# EAGLE design Freeduino_Pico_V3_0a (EAGLE 5.00)
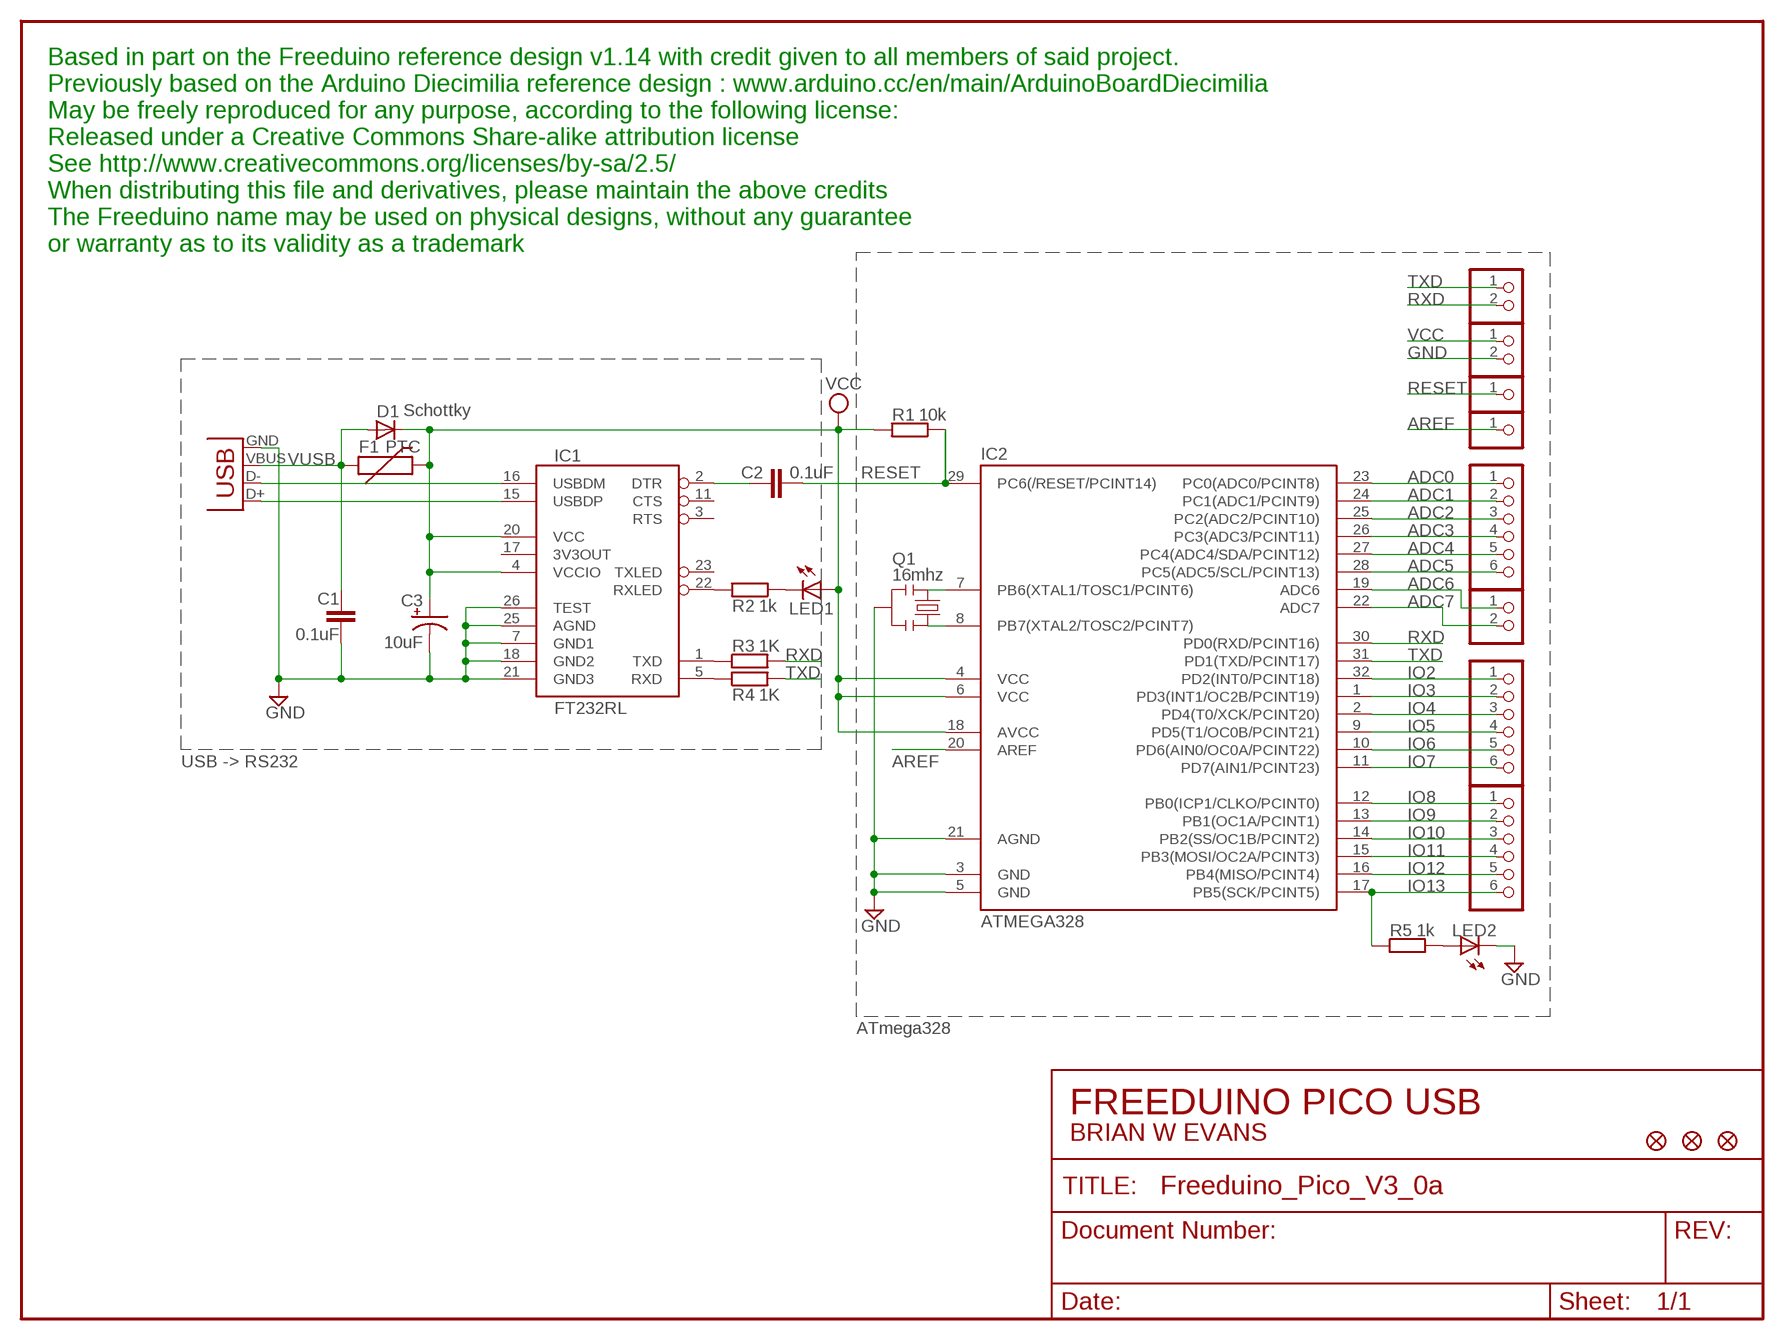
[diagram p0: schematic, sheet 1]

## Parts
C1  0.1uF  CAP0402  [C0402]
C2  0.1uF  CAP0402  [C0402]
C3  10uF  CAP_POL1206  [EIA3216]
D1  DIODESOD  [SOD-323]
F1  PTC  PTCSMD  [PTC-1206]
IC1  FT232RL  FT232RL-BASIC-DTR  [SSOP28DB]
IC2  ATMEGA328  ATMEGA48/88/168RD  [TQFP32-45-ROUND]
JP1  PINHD-1X6  [1X06]
JP2  PINHD-1X2  [1X02]
JP3  PINHD-1X6  [1X06]
JP4  PINHD-1X6  [1X06]
JP5  PINHD-1X2  [1X02]
JP6  PINHD-1X2  [1X02]
JP7  PINHD-1X1  [1X01]
JP8  PINHD-1X1  [1X01]
LED1  LEDCHIPLED_0603  [CHIPLED_0603]
LED2  LEDCHIPLED_0603  [CHIPLED_0603]
Q1  16mhz  RESONATORSMD  [RESONATOR-SMD]
R1  10k  R-EU_R0402  [R0402]
R2  1k  R-EU_R0402  [R0402]
R3  1K  R-EU_R0402  [R0402]
R4  1K  R-EU_R0402  [R0402]
R5  1k  R-EU_R0402  [R0402]
U$2  FIDUCIAL1X2  [FIDUCIAL-1X2]
U$4  FIDUCIAL1X2  [FIDUCIAL-1X2]
U$5  FIDUCIAL1X2  [FIDUCIAL-1X2]
X1  USBSMD  [USB-MINIB]

## Nets
ADC0: IC2.23(PC0(ADC0/PCINT8)) JP1.1
ADC1: IC2.24(PC1(ADC1/PCINT9)) JP1.2
ADC2: IC2.25(PC2(ADC2/PCINT10)) JP1.3
ADC3: IC2.26(PC3(ADC3/PCINT11)) JP1.4
ADC4: IC2.27(PC4(ADC4/SDA/PCINT12)) JP1.5
ADC5: IC2.28(PC5(ADC5/SCL/PCINT13)) JP1.6
ADC6: IC2.19(ADC6) JP2.1
ADC7: IC2.22(ADC7) JP2.2
AREF: IC2.20(AREF) JP7.1
GND: C1.1 C3.C(-) IC1.7(GND1) IC1.18(GND2) IC1.21(GND3) IC1.25(AGND) IC1.26(TEST) IC2.3(GND) IC2.5(GND) IC2.21(AGND) JP6.2 LED2.C Q1.2 X1.GND
IO2: IC2.32(PD2(INT0/PCINT18)) JP3.1
IO3: IC2.1(PD3(INT1/OC2B/PCINT19)) JP3.2
IO4: IC2.2(PD4(T0/XCK/PCINT20)) JP3.3
IO5: IC2.9(PD5(T1/OC0B/PCINT21)) JP3.4
IO6: IC2.10(PD6(AIN0/OC0A/PCINT22)) JP3.5
IO7: IC2.11(PD7(AIN1/PCINT23)) JP3.6
IO8: IC2.12(PB0(ICP1/CLKO/PCINT0)) JP4.1
IO9: IC2.13(PB1(OC1A/PCINT1)) JP4.2
IO10: IC2.14(PB2(SS/OC1B/PCINT2)) JP4.3
IO11: IC2.15(PB3(MOSI/OC2A/PCINT3)) JP4.4
IO12: IC2.16(PB4(MISO/PCINT4)) JP4.5
IO13: IC2.17(PB5(SCK/PCINT5)) JP4.6 R5.1
N$1: IC1.16(USBDM) X1.D-
N$2: IC1.15(USBDP) X1.D+
N$3: LED1.C R2.1
N$4: IC1.5(RXD) R4.1
N$5: C2.1 IC1.2(DTR)
N$7: IC2.7(PB6(XTAL1/TOSC1/PCINT6)) Q1.1
N$8: IC2.8(PB7(XTAL2/TOSC2/PCINT7)) Q1.3
N$9: IC1.1(TXD) R3.1
N$11: IC1.22(RXLED) R2.2
N$12: LED2.A R5.2
RESET: C2.2 IC2.29(PC6(/RESET/PCINT14)) JP8.1 R1.1
RXD: IC2.30(PD0(RXD/PCINT16)) JP5.2 R3.2
TXD: IC2.31(PD1(TXD/PCINT17)) JP5.1 R4.2
VCC: C3.A(+) D1.1(C) F1.2 IC1.4(VCCIO) IC1.20(VCC) IC2.4(VCC) IC2.6(VCC) IC2.18(AVCC) JP6.1 LED1.A R1.2
VUSB: C1.2 D1.2(A) F1.1 X1.VBUS
Unconnected: IC1.3(RTS) IC1.11(CTS) IC1.17(3V3OUT) IC1.23(TXLED)

## Notes on the sheet
- Based in part on the Freeduino reference design v1.14 with credit given to all members of said project.
- Previously based on the Arduino Diecimilia reference design : www.arduino.cc/en/main/ArduinoBoardDiecimilia
- May be freely reproduced for any purpose, according to the following license:
- Released under a Creative Commons Share-alike attribution license
- See http://www.creativecommons.org/licenses/by-sa/2.5/
- When distributing this file and derivatives, please maintain the above credits
- The Freeduino name may be used on physical designs, without any guarantee
- or warranty as to its validity as a trademark
- Schottky
- USB -> RS232
- ATmega328
- FREEDUINO PICO USB
- BRIAN W EVANS

## Library data of the parts
C1 C2 = SparkFun:CAP: Capacitor Standard 0603 ceramic capacitor, and 0.1" leaded capacitor.
C3 = SparkFun:CAP_POL: Capacitor Polarized These are standard SMD and PTH capacitors. Normally 10uF, 47uF, and 100uF in electrolytic and tantalum varieties. Always verify the external diameter of the through hole cap, it varies with capacity, voltage, and manufacturer. The EIA devices should be standard.
D1 = SparkFun-3-2-07:DIODE: Diode These are standard reverse protection diodes and small signal diodes. SMA package can handle up to about 1A. SOD-323 can handle about 200mA. What the SOD-323 package when ordering, there are some mfgs out there that are 5-pin packages.
F1 = SparkFun:PTC: Resettable Fuse PTC Resettable Fuse. Spark Fun Electronics SKU : COM-08357
IC1 = SparkFun:FT232RL-BASIC-DTR
IC2 = atmega8:ATMEGA48/88/168
JP1 JP3 JP4 = pinhead2:PINHD-1X6: PIN HEADER
JP2 JP5 JP6 = pinhead2:PINHD-1X2: PIN HEADER
JP7 JP8 = pinhead2:PINHD-1X1: PIN HEADER
LED1 LED2 = led:LED: LED OSRAM: - CHIPLED LG R971, LG N971, LY N971, LG Q971, LY Q971, LO R971, LY R971 LH N974, LH R974 LS Q976, LO Q976, LY Q976 LO Q996 - Hyper CHIPLED LW Q18S LB Q993, LB Q99A, LB R99A - SideLED LS A670, LO A670, LY A670, LG A670, LP A670 LB A673, LV A673, LT A673, LW A673 LH A674 LY A675 LS A676, LA A676, LO A676, LY A676, LW A676 LS A679, LY A679, LG A679 - Hyper Micro SIDELED® LS Y876, LA Y876, LO Y876, LY Y876 LT Y87S - SmartLED LW L88C, LW L88S LB L89C, LB L89S, LG L890 LS L89K, LO L89K, LY L89K LS L896, LA L896, LO L896, LY L896 - TOPLED LS T670, LO T670, LY T670, LG T670, LP T670 LSG T670, LSP T670, LSY T670, LOP T670, LYG T670 LG T671, LOG T671, LSG T671 LB T673, LV T673, LT T673, LW T673 LH T674 LS T676, LA T676, LO T676, LY T676, LB T676, LH T676, LSB T676, LW T676 LB T67C, LV T67C, LT T67C, LS T67K, LO T67K, LY T67K, LW E67C LS E67B, LA E67B, LO E67B, LY E67B, LB E67C, LV E67C, LT E67C LW T67C LS T679, LY T679, LG T679 LS T770, LO T770, LY T770, LG T770, LP T770 LB T773, LV T773, LT T773, LW T773 LH T774 LS E675, LA E675, LY E675, LS T675 LS T776, LA T776, LO T776, LY T776, LB T776 LHGB T686 LT T68C, LB T68C - Hyper Mini TOPLED® LB M676 - Mini TOPLED Santana® LG M470 LS M47K, LO M47K, LY M47K Source: http://www.osram.convergy.de - LUMILED® LXK2-PW12-R00, LXK2-PW12-S00, LXK2-PW14-U00, LXK2-PW14-V00 LXK2-PM12-R00, LXK2-PM12-S00, LXK2-PM14-U00 LXK2-PE12-Q00, LXK2-PE12-R00, LXK2-PE12-S00, LXK2-PE14-T00, LXK2-PE14-U00 LXK2-PB12-K00, LXK2-PB12-L00, LXK2-PB12-M00, LXK2-PB14-N00, LXK2-PB14-P00, LXK2-PB14-Q00 LXK2-PR12-L00, LXK2-PR12-M00, LXK2-PR14-Q00, LXK2-PR14-R00 LXK2-PD12-Q00, LXK2-PD12-R00, LXK2-PD12-S00 LXK2-PH12-R00, LXK2-PH12-S00 LXK2-PL12-P00, LXK2-PL12-Q00, LXK2-PL12-R00 Source: www.luxeon.com
Q1 = SparkFun:RESONATOR: Resonator Small SMD resonator. This is the itty bitty 10/20MHz resonators with built in caps. CSTCE10M0G55 and CSTCE20M0V53. Footprint has been reviewed closely but hasn't been tested yet.
R1-R5 = rcl:R-EU_: RESISTOR, European symbol
U$2 U$4 U$5 = SparkFun:FIDUCIAL: Fiducial Alignment Points Various fiducial points for machine vision alignment.
X1 = SparkFun:USB: USB Connectors USB-B-PTH is fully proven SKU : PRT-00139 USB-miniB is fully proven SKU : PRT-00587 USB-A-PCB is untested. USB-A-H is throughly reviewed, but untested. Spark Fun Electronics SKU : PRT-00437 USB-B-SMT is throughly reviewed, but untested. Needs silkscreen touching up. USB-A-S has not been used/tested USB-MB-H has not been used/tested

## Net classes
1 power: width 0.508 mm, clearance 0.305 mm

## Board
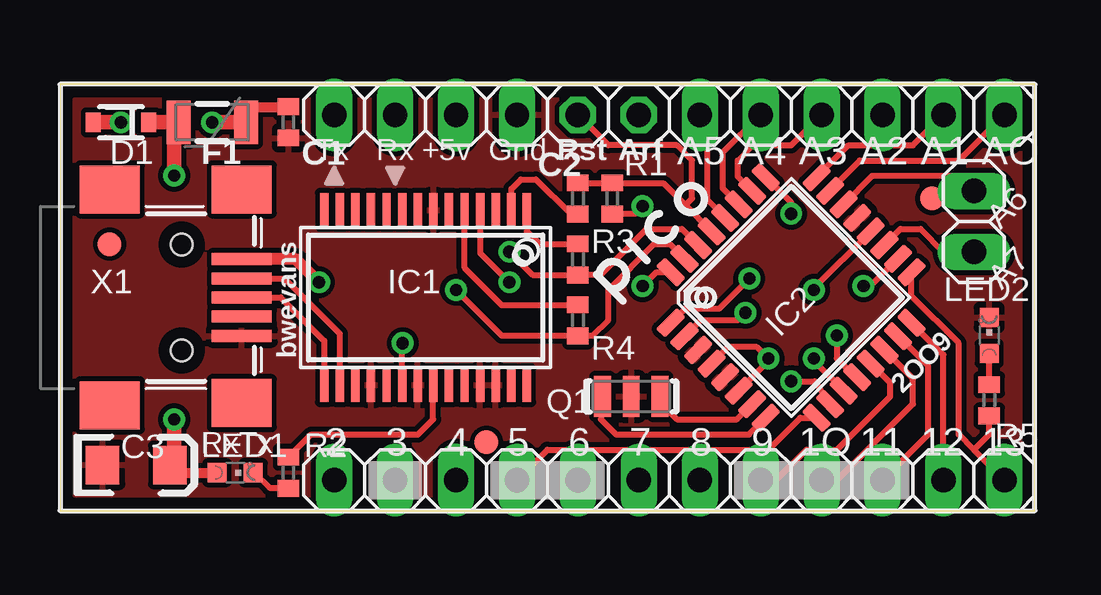
[diagram p1: board, top side]
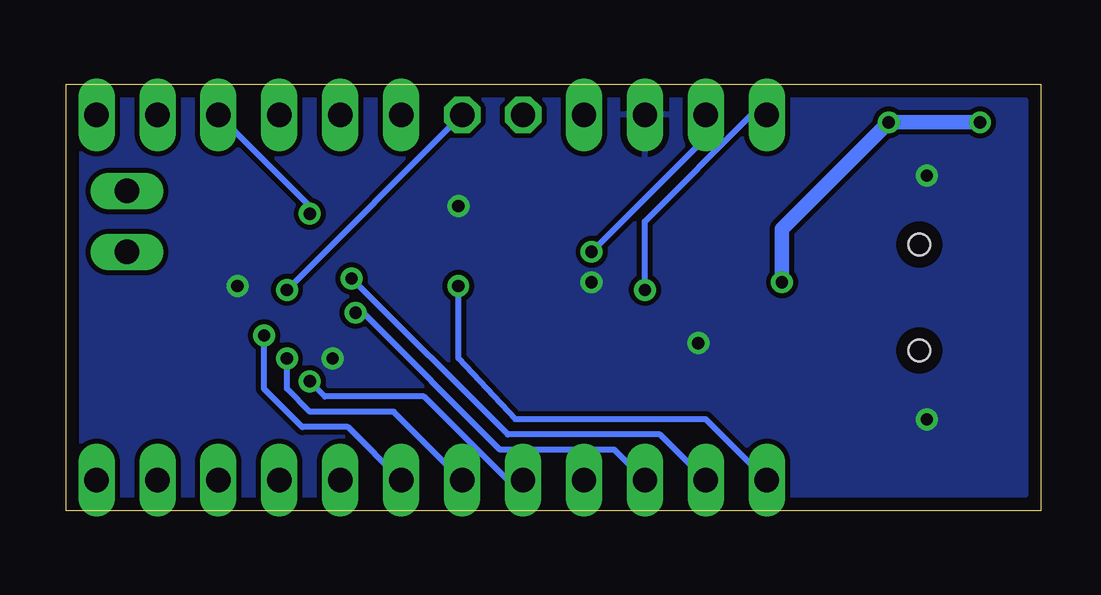
[diagram p2: board, bottom side, seen from below]

Size 40.64 x 17.78 mm. Coordinates in mm from the lower left corner, seen from the top.
Outline: 0,0 40.64,0 40.64,17.78 0,17.78 0,0
Copper layers (1*16): Top 0.035mm / dielectric 1.5mm / Bottom 0.035mm
Design rules "default *": minimum track width 8mil, minimum drill 20mil, track to track 8mil, track to pad 8mil, pad to pad 8mil, via to via 8mil, smd to smd 8mil, copper to edge 20mil, drill to drill 10mil, minimum pad ring 10mil, minimum via ring 8mil, stop-mask expansion 4mil, vias tented up to drill 20mil, thermal gap 10mil

### Footprints (pad centres in the part's own frame; a part is rotated, then mirrored left to right if it is on the bottom)
C0402 = smd 0.7 x 0.9: 1 -0.65,0; 2 0.65,0
EIA3216 = smd 1.4 x 1.6: A 1.4,0; C -1.4,0
SOD-323 = smd 0.63 x 0.83: 1 -1.15,0; 2 1.15,0
PTC-1206 = smd 1 x 1.8: 1 -1.4,0; 2 1.4,0
SSOP28DB = smd 0.348 x 1.397: 1 -4.225,-3.656; 2 -3.575,-3.656; 3 -2.925,-3.656; 4 -2.275,-3.656; 5 -1.625,-3.656; 6 -0.975,-3.656; 7 -0.325,-3.656; 8 0.325,-3.656; 9 0.975,-3.656; 10 1.625,-3.656; 11 2.275,-3.656; 12 2.925,-3.656; 13 3.575,-3.656; 14 4.225,-3.656; 15 4.225,3.656; 16 3.575,3.656; 17 2.925,3.656; 18 2.275,3.656; 19 1.625,3.656; 20 0.975,3.656; 21 0.325,3.656; 22 -0.325,3.656; 23 -0.975,3.656; 24 -1.625,3.656; 25 -2.275,3.656; 26 -2.925,3.656; 27 -3.575,3.656; 28 -4.225,3.656
TQFP32-45-ROUND = smd 1.27 x 0.559 rotated 45: 1 -5.015,-1.055; 2 -4.449,-1.621; 3 -3.884,-2.187; 4 -3.318,-2.752; 5 -2.752,-3.318; 6 -2.187,-3.884; 7 -1.621,-4.449; 8 -1.055,-5.015; 17 5.015,1.055; 18 4.449,1.621; 19 3.884,2.187; 20 3.318,2.752; 21 2.752,3.318; 22 2.187,3.884; 23 1.621,4.449; 24 1.055,5.015 | smd 0.559 x 1.27 rotated 45: 9 1.055,-5.015; 10 1.621,-4.449; 11 2.187,-3.884; 12 2.752,-3.318; 13 3.318,-2.752; 14 3.884,-2.187; 15 4.449,-1.621; 16 5.015,-1.055; 25 -1.055,5.015; 26 -1.621,4.449; 27 -2.187,3.884; 28 -2.752,3.318; 29 -3.318,2.752; 30 -3.884,2.187; 31 -4.449,1.621; 32 -5.015,1.055
1X06 = drill 1.016 long: 1 -6.35,0; 2 -3.81,0; 3 -1.27,0; 4 1.27,0; 5 3.81,0; 6 6.35,0
1X02 = drill 1.016 long: 1 -1.27,0; 2 1.27,0
1X01 = drill 1.016 octagon: 1 0,0
CHIPLED_0603 = smd 0.8 x 0.8: A 0,-0.75; C 0,0.75
RESONATOR-SMD = smd 0.7 x 1.7: 1 -1.2,0; 2 0,0; 3 1.2,0
R0402 = smd 0.7 x 0.9: 1 -0.65,0; 2 0.65,0
FIDUCIAL-1X2 = smd 1 x 1: 1 0,0
USB-MINIB = smd 2.5 x 0.5: D+ 2.5,0; D- 2.5,0.8; GND 2.5,-1.6; ID 2.5,-0.8; VBUS 2.5,1.6 | smd 2.5 x 2: P$1 -3,-4.5; P$2 -3,4.5; P$3 2.5,-4.4; P$4 2.5,4.5 | hole 0.9: 0,2.2; 0,-2.2

### Placement (x,y rotation side)
C1  9.53,16.19 90 top
C2  21.59,13.02 90 top
C3  3.17,1.91 0 top
D1  2.54,16.19 180 top
F1  6.35,16.19 180 top
IC1  15.24,8.89 180 top
IC2  30.48,8.89 0 top
JP1  33.02,16.51 180 top
JP2  38.1,12.06 90 top
JP3  17.78,1.27 0 top
JP4  33.02,1.27 0 top
JP5  12.7,16.51 0 top
JP6  17.78,16.51 0 top
JP7  24.13,16.51 0 top
JP8  21.59,16.51 0 top
LED1  7.3,1.59 270 top
LED2  38.73,7.3 0 top
Q1  23.81,4.76 180 top
R1  23.02,13.02 270 top
R2  9.53,1.59 90 top
R3  21.59,10.48 270 top
R4  21.59,7.94 270 top
R5  38.73,4.6 90 top
U$2  17.78,2.86 0 top
U$4  36.35,13.02 0 top
U$5  2.06,11.11 0 top
X1  5.08,8.89 0 top

### Tracks (layer width: path | path; a pad name or v marks a point on that pad's centre or on a via)
ADC0
  Top 0.254: IC2.23 33.34,14.61 37.47,14.61 JP1.1
ADC1
  Top 0.254: IC2.24 32.87,15.24 35.56,15.24 JP1.2
ADC2  (via drill 0.51)
  Top 0.254: IC2.25 30.48,12.85 v30.48,12.38
  Bottom 0.254: v30.48,12.38 30.48,12.7 JP1.3
ADC3
  Top 0.254: IC2.26 28.26,13.94 28.26,14.61 28.89,15.24 30.48,15.24 JP1.4
ADC4
  Top 0.254: IC2.27 27.62,13.45 27.62,14.92 JP1.5
ADC5
  Top 0.254: JP1.6 26.99,16.19 26.99,12.95 IC2.28
ADC6
  Top 0.254: JP2.1 36.83,10.79 35.88,11.75 35.03,11.75 IC2.19
ADC7
  Top 0.254: IC2.22 33.86,13.97 37.47,13.97 JP2.2
AREF  (via drill 0.51)
  Top 0.254: IC2.20 31.43,9.28 v31.43,9.21
  Bottom 0.254: JP7.1 v31.43,9.21
GND
  pour Top (isolate 0.203): 0.64,17.14 40.01,17.14 40.01,0.64 0.64,0.64
IO2  (via drill 0.51)
  Top 0.254: IC2.32 24.87,9.95 v24.29,9.37
  Bottom 0.254: v24.29,9.37 24.29,6.35 21.91,3.81 13.97,3.81 JP3.1
IO3  (via drill 0.51)
  Top 0.254: IC2.1 26.04,8.41 27.46,8.41 v28.73,9.68
  Bottom 0.254: JP3.2 15.88,3.17 22.23,3.17 v28.73,9.68
IO4  (via drill 0.51)
  Top 0.254: IC2.2 26.7,7.94 28.26,7.94 v28.57,8.26
  Bottom 0.254: JP3.3 17.78,2.54 22.54,2.54 28.26,8.26 v28.57,8.26
IO5
  Top 0.254: IC2.9 30.86,3.88 29.53,2.54 20.32,2.54 JP3.4
IO6  (via drill 0.51)
  Top 0.254: IC2.10 31.46,5.4 v30.48,5.4
  Bottom 0.254: v30.48,5.4 29.84,4.76 25.72,4.76 22.23,1.27 JP3.5
IO7  (via drill 0.51)
  Top 0.254: IC2.11 31.48,6.19 v31.43,6.35
  Bottom 0.254: v31.43,6.35 31.43,5.08 30.48,4.13 26.99,4.13 JP3.6
IO8  (via drill 0.51)
  Top 0.254: IC2.12 33.02,5.71 32.38,6.35 v32.38,7.3
  Bottom 0.254: v32.38,7.3 32.38,5.08 30.8,3.49 28.89,3.49 JP4.1
IO9
  Top 0.254: IC2.13 34.61,5.33 34.61,4.76 32.38,2.54 31.11,2.54 29.84,1.27 JP4.2
IO10
  Top 0.254: IC2.14 35.56,5.51 35.56,4.45 32.38,1.27 JP4.3
IO11
  Top 0.254: IC2.15 34.96,7.27 36.2,6.03 36.2,3.17 JP4.4
IO12
  Top 0.254: IC2.16 36.83,6.5 JP4.5
IO13
  Top 0.254: IC2.17 35.49,8.96 37.47,6.99 37.47,3.17 38.1,2.54 | JP4.6 38.1,2.54 | R5.1 38.73,3.17 38.1,2.54
N$1
  Top 0.254: IC1.16 11.66,7.38 9.37,9.68 7.62,9.68 7.61,9.69 X1.D-
N$2
  Top 0.254: IC1.15 11.02,7.08 9.21,8.89 X1.D+
N$3
  Top 0.254: R2.1 9.53,0.95 8.73,0.95 8.1,1.59 LED1.C
N$4
  Top 0.254: IC1.5 16.86,10.12 18.41,8.57 21.75,8.57 R4.1
N$5
  Top 0.254: IC1.2 18.82,13.42 19.21,13.81 19.84,13.81 21.27,12.38 21.75,12.38 C2.1
N$7
  Top 0.254: IC2.7 28.23,3.81 25.72,3.81 25.08,4.45 25.08,4.76 Q1.1
N$8
  Top 0.254: IC2.8 28.73,3.17 23.18,3.17 22.54,3.81 22.54,4.76 Q1.3
N$9
  Top 0.254: IC1.1 19.46,11.65 20,11.11 21.75,11.11 R3.1
N$11
  Top 0.254: R2.2 10.48,3.17 14.92,3.17 15.56,3.81 15.56,5.08 15.56,5.09 IC1.22
N$12
  Top 0.254: LED2.A 38.73,6.67 R5.2
RESET
  Top 0.254: 23.02,13.65 R1.1 | 26.07,12.73 25.15,13.65 23.02,13.65 | 26.07,12.73 IC2.29 | C2.2 21.75,13.65 23.02,13.65 | JP8.1 22.86,15.24 25.72,15.24 26.35,14.61 26.35,13.02 26.07,12.73
RXD  (via drill 0.51)
  Top 0.254: IC2.30 25.93,11.75 24.45,11.75 22.54,9.84 21.75,9.84 R3.2 19.7,9.83 v18.73,10.79
  Bottom 0.254: JP5.2 13.97,15.56 v18.73,10.79
TXD  (via drill 0.51)
  Top 0.254: IC2.31 25.43,11.11 24.77,11.11 22.86,9.21 22.86,7.94 22.23,7.3 21.75,7.3 | 21.75,7.3 R4.2 | v16.51,9.21 18.41,7.3 21.75,7.3
  Bottom 0.254: JP5.1 12.06,16.51 16.51,12.06 v16.51,9.21
VCC  (via drill 0.51)
  Top 0.254: R1.2 23.18,12.38 23.97,12.38 v24.29,12.7 | IC1.4 17.52,10.74 v18.73,9.53 | IC1.20 14.27,6.96 v14.29,6.99 | IC2.4 27.85,6.83 29.05,6.83 v29.53,6.35 29.48,6.19 IC2.6 | IC2.18 33.78,9.37 v33.5,9.37
  Top 0.406: C3.A 4.45,1.77 4.45,1.59 LED1.A
  Top 0.61: 5.08,16.19 | F1.2 5.08,16.19 | 4.76,16.19 5.08,16.19 | 4.76,16.19 | 4.76,16.19 F1.2 | v4.76,13.97 4.76,16.19 | C3.A 4.76,1.91 v4.76,3.81 | 5.08,16.19 | F1.2 5.08,16.19 | 5.08,16.19 D1.1
  pour Bottom (isolate 0.203): 0.64,17.14 0.64,0.64 40.01,0.64 40.01,17.14
VUSB  (via drill 0.51)
  Top 0.406: C1.2 9.51,16.83 7.62,16.83 7.62,16.19 F1.1 | F1.1
  Top 0.508: X1.VBUS 9.83,10.49 v10.79,9.53
  Top 0.61: 7.62,16.19 | 7.62,16.19 F1.1 | v6.35,16.19 7.62,16.19 | D1.2 v2.54,16.19
  Bottom 0.61: v10.79,9.53 10.79,11.75 v6.35,16.19 v2.54,16.19

### Text on the board
tNames: F1 | R1 | LED1
_tsilk: Tx | Rx | + | 5v | Gnd | Rst | Arf | A5 | A4 | A3 | A2 | A1 | AO | A6 | A7 | bwevans | 2OO9 | Rx | Tx | 2 | 3 | 4 | 5 | 6 | 7 | 8 | 9 | 1O | 11 | 12 | 13